# EAGLE design wifilights-shim (EAGLE 7.2.0)
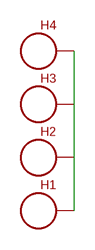
[diagram p0: schematic, sheet 1]

## Parts
H1  SEW_HOLE  [SIMPLE_HOLE]
H2  SEW_HOLE  [SIMPLE_HOLE]
H3  SEW_HOLE  [SIMPLE_HOLE]
H4  SEW_HOLE  [SIMPLE_HOLE]

## Nets
GND: H1.P$1 H2.P$1 H3.P$1 H4.P$1

## Library data of the parts
H1-H4 = LilyPad-Wearables:SEW_HOLE: Simple sew-hole .1" diameter hole with 20mil annular ring

## Board
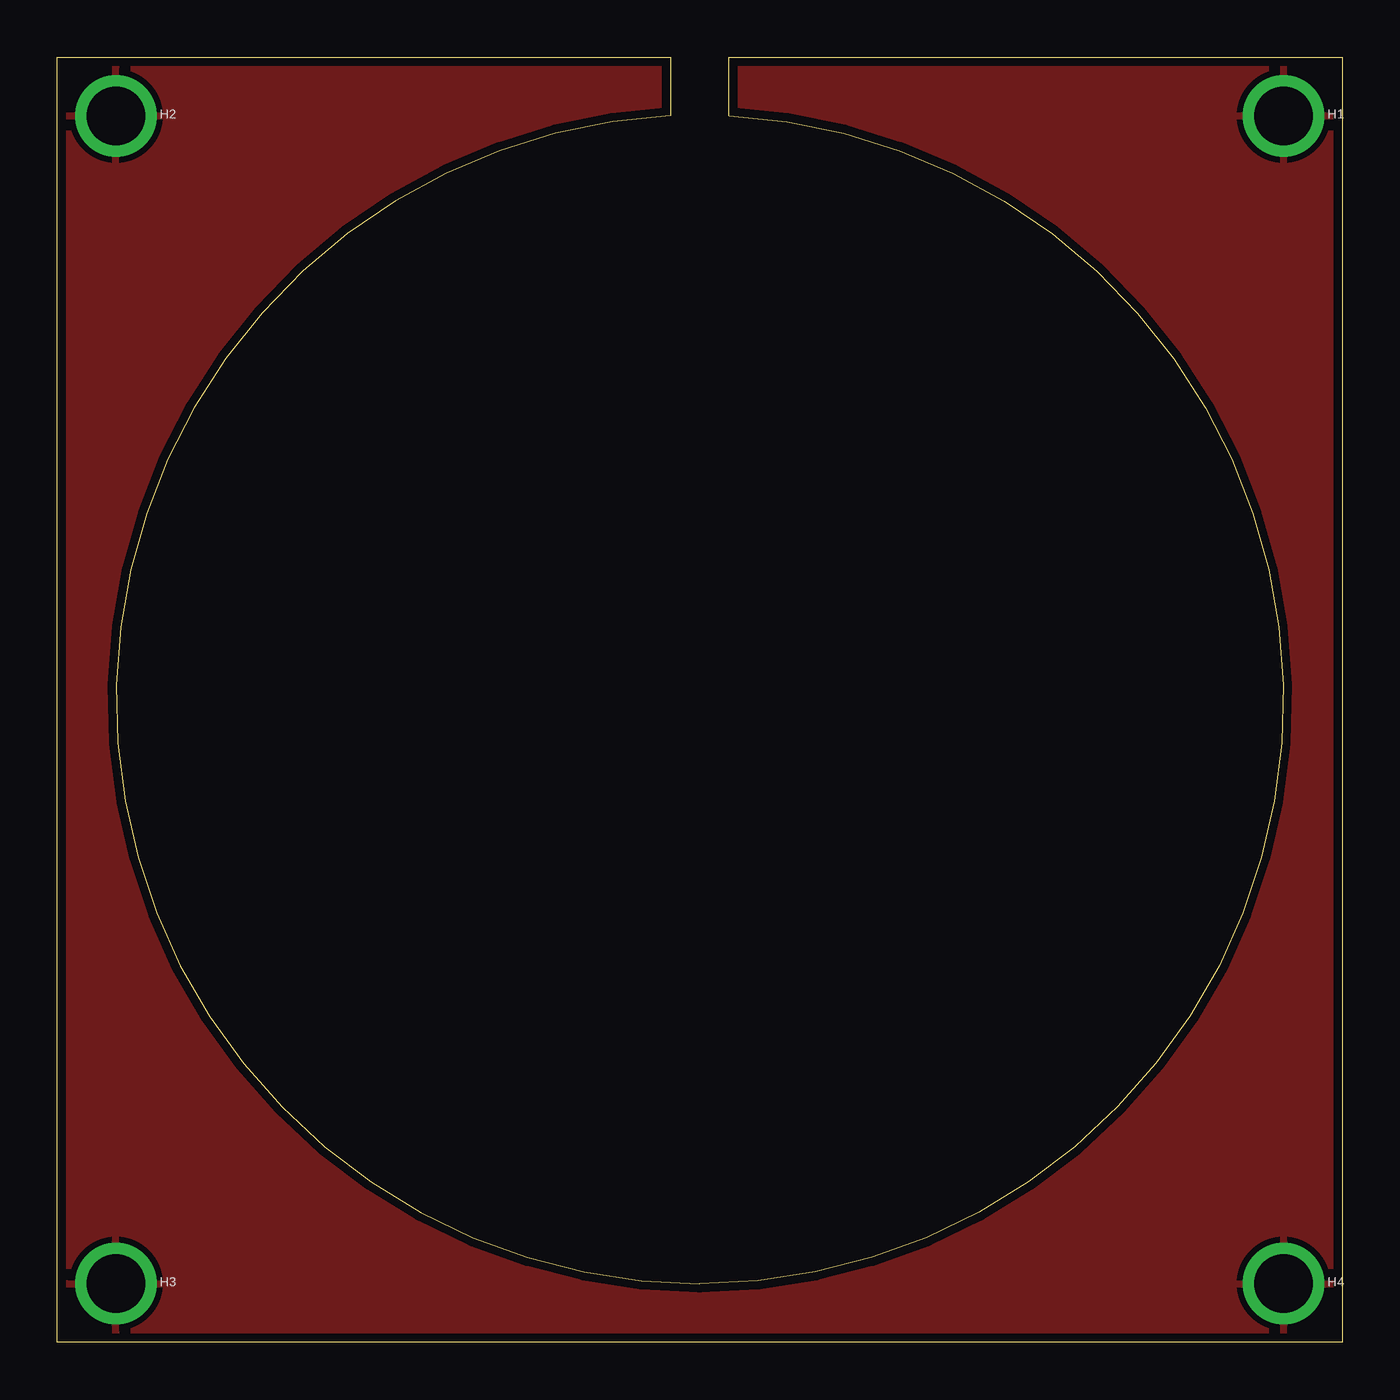
[diagram p1: board, top side]
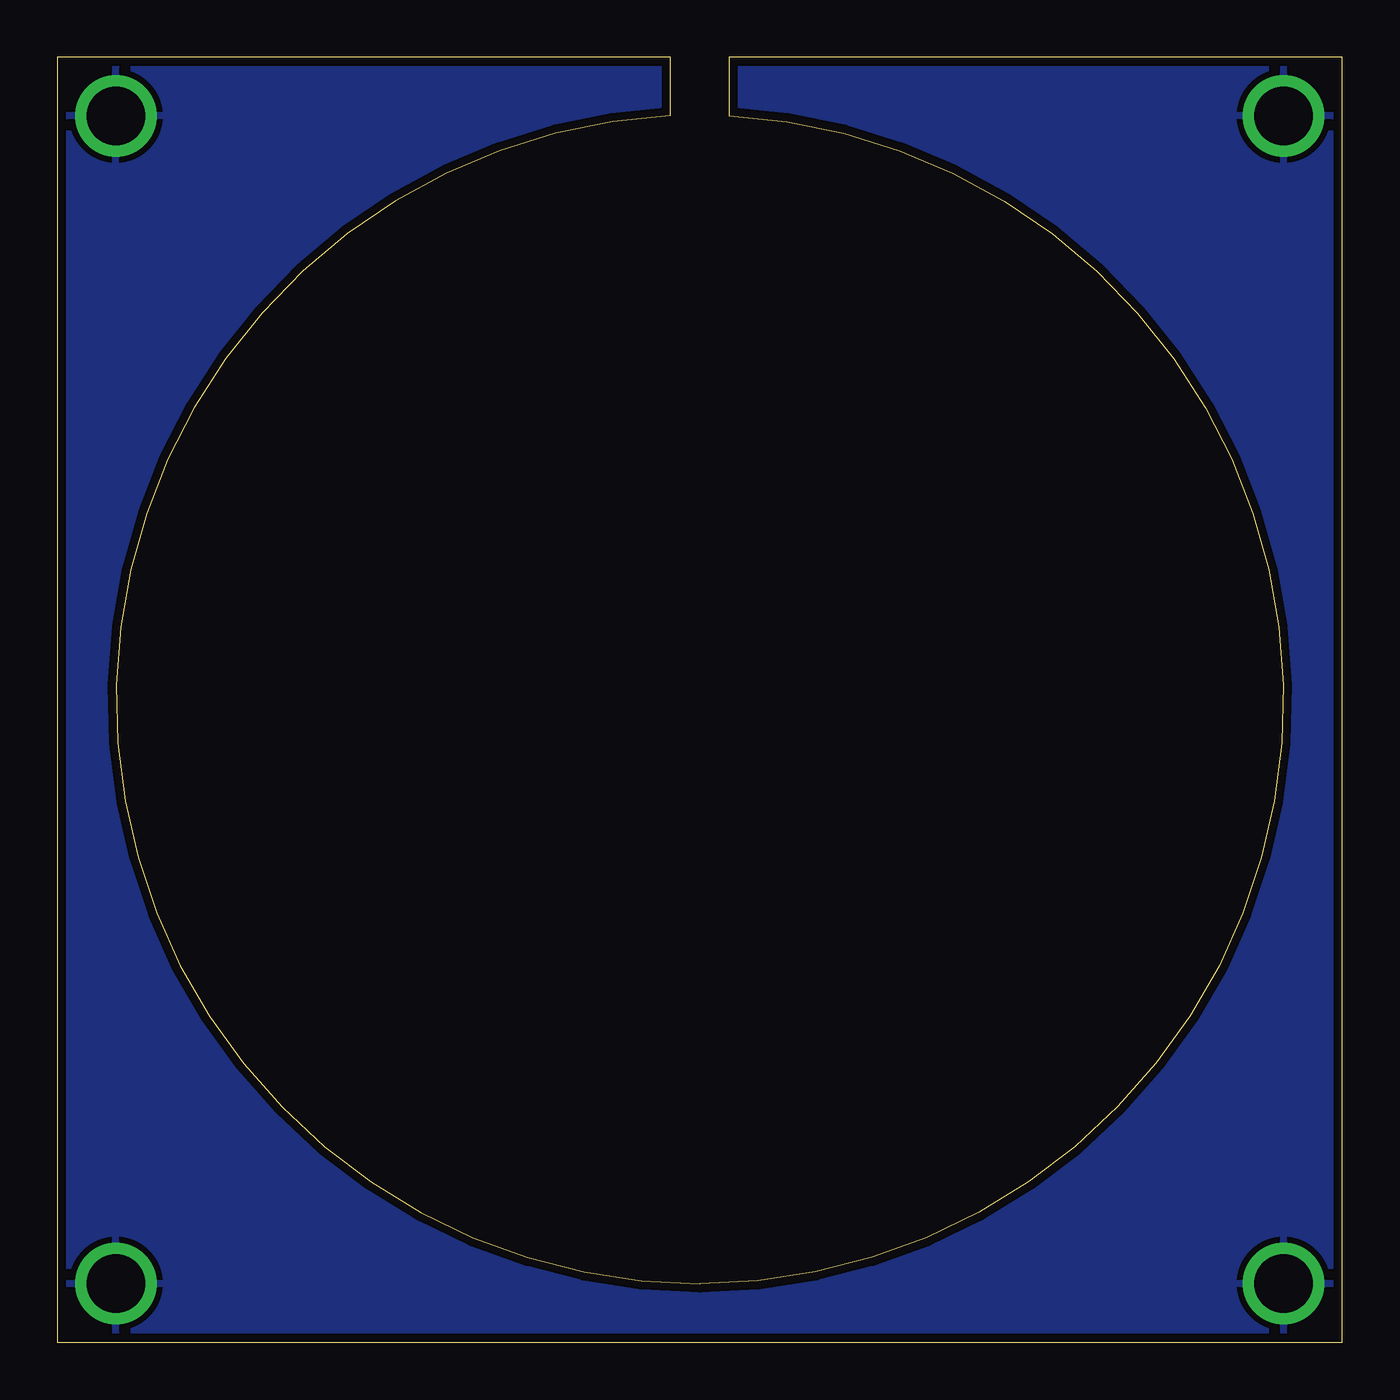
[diagram p2: board, bottom side, seen from below]

Size 55.88 x 55.88 mm. Coordinates in mm from the lower left corner, seen from the top.
Outline: 0,0 0,55.88 26.67,55.88 26.67,53.34 arc177 27.94,2.54 arc177 29.21,53.34 29.21,55.88 55.88,55.88 55.88,0 0,0
Copper layers (1*16): Top 0.0356mm / dielectric 1.5011mm / Bottom 0.0356mm
Design rules "LaenPCBOrder": minimum track width 6mil, minimum drill 13mil, track to track 6mil, track to pad 6mil, pad to pad 6mil, via to via 6mil, smd to smd 6mil, copper to edge 15mil, drill to drill 6mil, minimum pad ring 7mil, minimum via ring 7mil, stop-mask expansion 3mil, vias tented up to drill 0mil, thermal gap 10mil

### Footprints (pad centres in the part's own frame; a part is rotated, then mirrored left to right if it is on the bottom)
SIMPLE_HOLE = drill 2.54 pad 3.048: P$1 0,0

### Placement (x,y rotation side)
H1  53.34,53.34 0 top
H2  2.54,53.34 0 top
H3  2.54,2.54 0 top
H4  53.34,2.54 0 top

### Tracks (layer width: path | path; a pad name or v marks a point on that pad's centre or on a via)
GND
  pour Bottom: 0,55.88 0,0 55.88,0 55.88,55.88 29.21,55.88 29.21,53.34 arc-88 53.34,27.94 arc-90 27.94,2.54 arc-90 2.54,27.94 arc-88 26.67,53.34 26.67,55.88
  pour Top: 0,55.88 0,0 55.88,0 55.88,55.88 29.21,55.88 29.21,53.34 arc-88 53.34,27.94 arc-90 27.94,2.54 arc-90 2.54,27.94 arc-88 26.67,53.34 26.67,55.88